# EAGLE design PiZeroGeiger_REV_A (EAGLE 6.3)
CHECKED: C. Granz; DATE: 10.03.2017; DRAWN: C. Granz; DRGNO: 1; ORGANIZATION: Granz Scientific; REV: A; TITLE: PI Zero Geiger
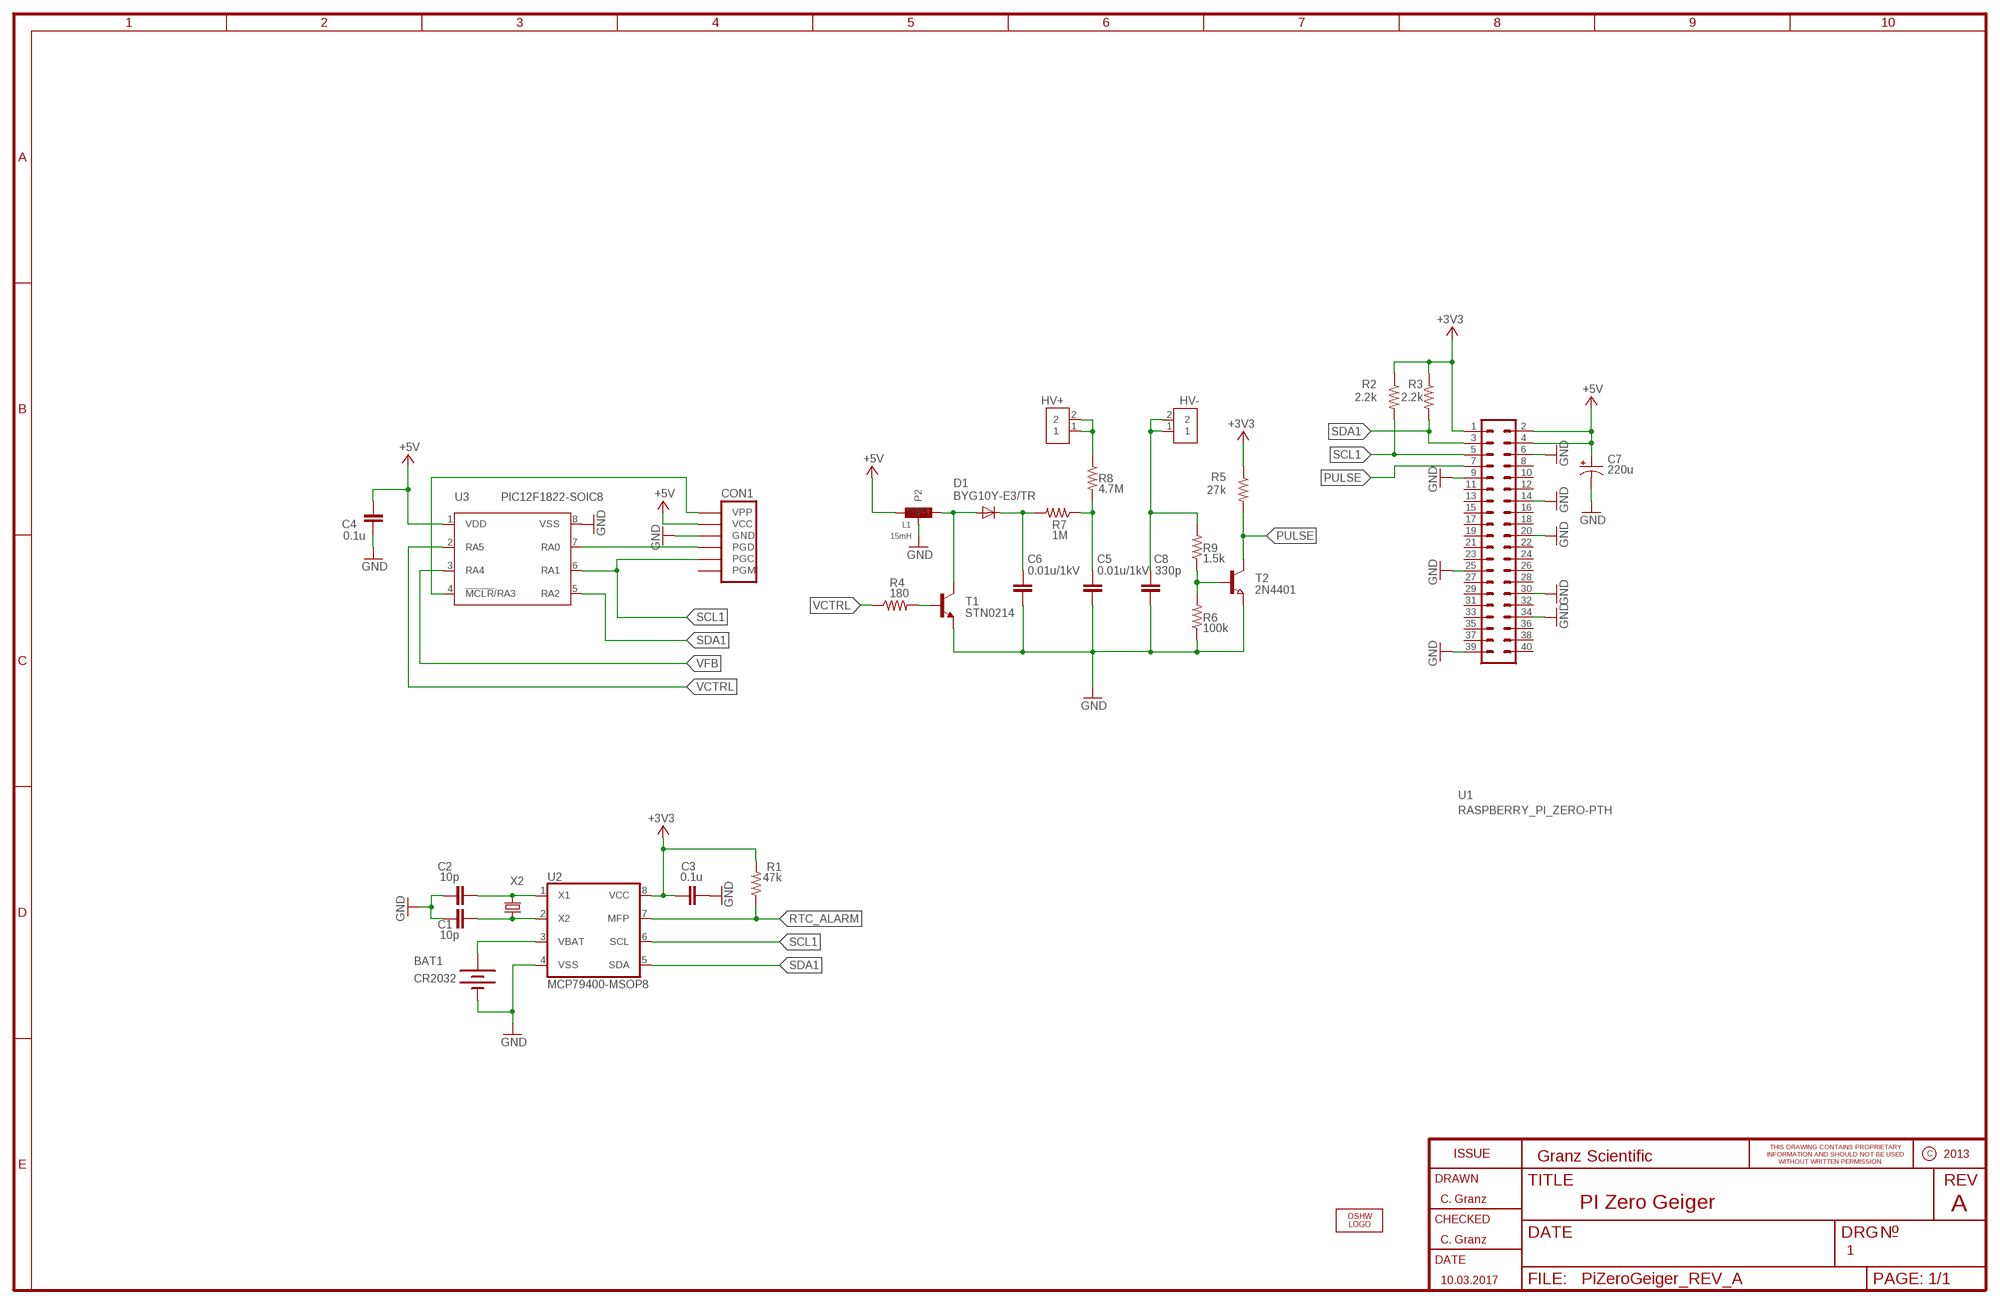
[diagram p0: schematic, sheet 1]

## Parts
BAT1  CR2032  BATTERY-BK-885  [BATTERY_HOLDER_12MM_BK-885]
C1  10p  CAPACITOR-0805  [RCL_0805]
C2  10p  CAPACITOR-0805  [RCL_0805]
C3  0.1u  CAPACITOR-0805  [RCL_0805]
C4  0.1u  CAPACITOR-0805  [RCL_0805]
C5  0.01u/1kV  CAPACITOR-1812  [RCL_1812]
C6  0.01u/1kV  CAPACITOR-1812  [RCL_1812]
C7  220u  CAPACITOR_POLARIZED-PTH-2.5MM-7MM  [CAPACITOR_POLARIZED_PTH_2.5MM-7MM]
C8  330p  CAPACITOR-0805  [RCL_0805]
CON1  CON_PIC_ICSP  [CON_INLINE_TE_640456-6]
D1  BYG10Y-E3/TR  DIODE-DO-214AC  [DO-214AC]
HV+  FUSE_HOLDER-PTH  [FUSE_HOLDER_PTH]
HV-  FUSE_HOLDER-PTH  [FUSE_HOLDER_PTH]
L1  15mH  1200LRS  [1200LRS]
LOGO1  OSHW_LOGO_FILLX0150-NT  [OSHW_FILLX150_NOTEXT]
R1  47k  RESISTOR-0805  [RCL_0805]
R2  2.2k  RESISTOR-0805  [RCL_0805]
R3  2.2k  RESISTOR-0805  [RCL_0805]
R4  180  RESISTOR-0805  [RCL_0805]
R5  27k  RESISTOR-0805  [RCL_0805]
R6  100k  RESISTOR-0805  [RCL_0805]
R7  1M  RESISTOR-0805  [RCL_0805]
R8  4.7M  RESISTOR-0805  [RCL_0805]
R9  1.5k  RESISTOR-0805  [RCL_0805]
T1  STN0214  -NPN-SOT223  [SOT223]
T2  2N4401  NPN-TRANSISTOR_SOT23  [SOT23]
U1  RASPBERRY_PI_ZERO-PTH  [RASPBERRY_PI_ZERO]
U2  MCP79400-MSOP8  [MSOP8]
U3  PIC12F1822-SOIC8  [SOIC8]
X2  32.768 kHz 12.5 pF X1123-ND  CRYSTAL_2_PIN-4.9MM_X_1.8MM  [CRYSTAL_ABRACON_ABS10]

## Nets
+3V3: C3.2 R1.2 R2.1 R3.1 R5.1 U1.1 U2.8(VCC)
+5V: C4.1 C7.+ CON1.5(VCC) L1.P1 U1.2 U1.4 U3.1(VDD)
DIS: R4.2 T1.1(B)
GND: BAT1.- C1.2 C2.2 C3.1 C4.2 C5.2 C6.2 C7.- C8.2 CON1.4(GND) L1.P4(P2) R6.1 T1.3(E) T2.2(E) U1.6 U1.9 U1.14 U1.20 U1.25 U1.30 U1.34 U1.39 U2.4(VSS) U3.8(VSS)
N$2: CON1.6(VPP) U3.4(!MCLR!/RA3)
N$3: C6.1 D1.C R7.2
N$4: CON1.3(PGD) U3.7(RA0)
N$6: D1.A L1.P3 T1.4(C)
N$8: C5.1 R7.1 R8.2
N$9: R6.2 R9.1 T2.1(B)
N$11: C8.1 HV-.1 HV-.2 R9.2
N$12: HV+.1 HV+.2 R8.1
N$29: C1.1 U2.2(X2) X2.1
N$30: C2.1 U2.1(X1) X2.2
N$31: BAT1.+A(+) U2.3(VBAT)
PULSE: R5.2 T2.3(C) U1.7
RTC_ALARM: R1.1 U2.7(MFP)
SCL1: CON1.2(PGC) R2.2 U1.5 U2.6(SCL) U3.6(RA1)
SDA1: R3.2 U1.3 U2.5(SDA) U3.5(RA2)
VCTRL: R4.1 U3.2(RA5)
VFB: U3.3(RA4)
Unconnected: CON1.1(PGM) U1.8 U1.10 U1.11 U1.12 U1.13 U1.15 U1.16 U1.17 U1.18 U1.19 U1.21 U1.22 U1.23 U1.24 U1.26 U1.27 U1.28 U1.29 U1.31 U1.32 U1.33 U1.35 U1.36 U1.37 U1.38 U1.40

## Library data of the parts
BAT1 = CGranz:BATTERY: Battery Various Batteries and Battery Holders.; PN: BK-885-TR
C1 C2 = ArcadianElectronics:CAPACITOR; PN: 08051A100FAT2A
C3 = ArcadianElectronics:CAPACITOR; PN: C0805F104K5RACTU
C4 C8 = CGranz:CAPACITOR: Capacitor Various capacitor sizes.; EAGLEUP: C0805
C5 C6 = CGranz:CAPACITOR: Capacitor Various capacitor sizes.
C7 = CGranz:CAPACITOR_POLARIZED: Polarized Capacitor Various polarized capacitor sizes.
CON1 = CGranz:CON_PIC_ICSP: Microchip PIC ICSP Header OLIMEX style PIC In-Circuit-Serial-Programming header.; PN: 640456-6
D1 = CGranz:DIODE: Diode Various diode sizes.
HV+ HV- = CGranz:FUSE_HOLDER: Fuse Clip PCB mounted fuse clips.; PN: 01020074Z
L1 = murata-inductors:1200LRS
LOGO1 = ohw-logo:OSHW_LOGO_FILL
R1 = ArcadianElectronics:RESISTOR; PN: *
R2-R9 = CGranz:RESISTOR: Resistor Various resistor sizes.; EAGLEUP: R0805
T1 = transistor-neu-to92:*-NPN-: NPN Transistror
T2 = semicon-smd-ipc:NPN-TRANSISTOR_: NPN TRANSISTOR
U1 = CGranz:RASPBERRY_PI_ZERO: Raspberry Pi Zero
U2 = CGranz:MCP79400: Microchip Real-Time Clock IC; PN: MCP79400-I/SN
U3 = CGranz:PIC12F1822: Microchip 8-Bit PIC Microcontroller Microchip Low-end 8-bit PIC microcontroller in various packages.; PN: PIC12F1822-I/SN
X2 = CGranz:CRYSTAL_2_PIN: Crystal Various frequencies and sizes.; PN: ABS10-32.768KHZ-1-T

## Board
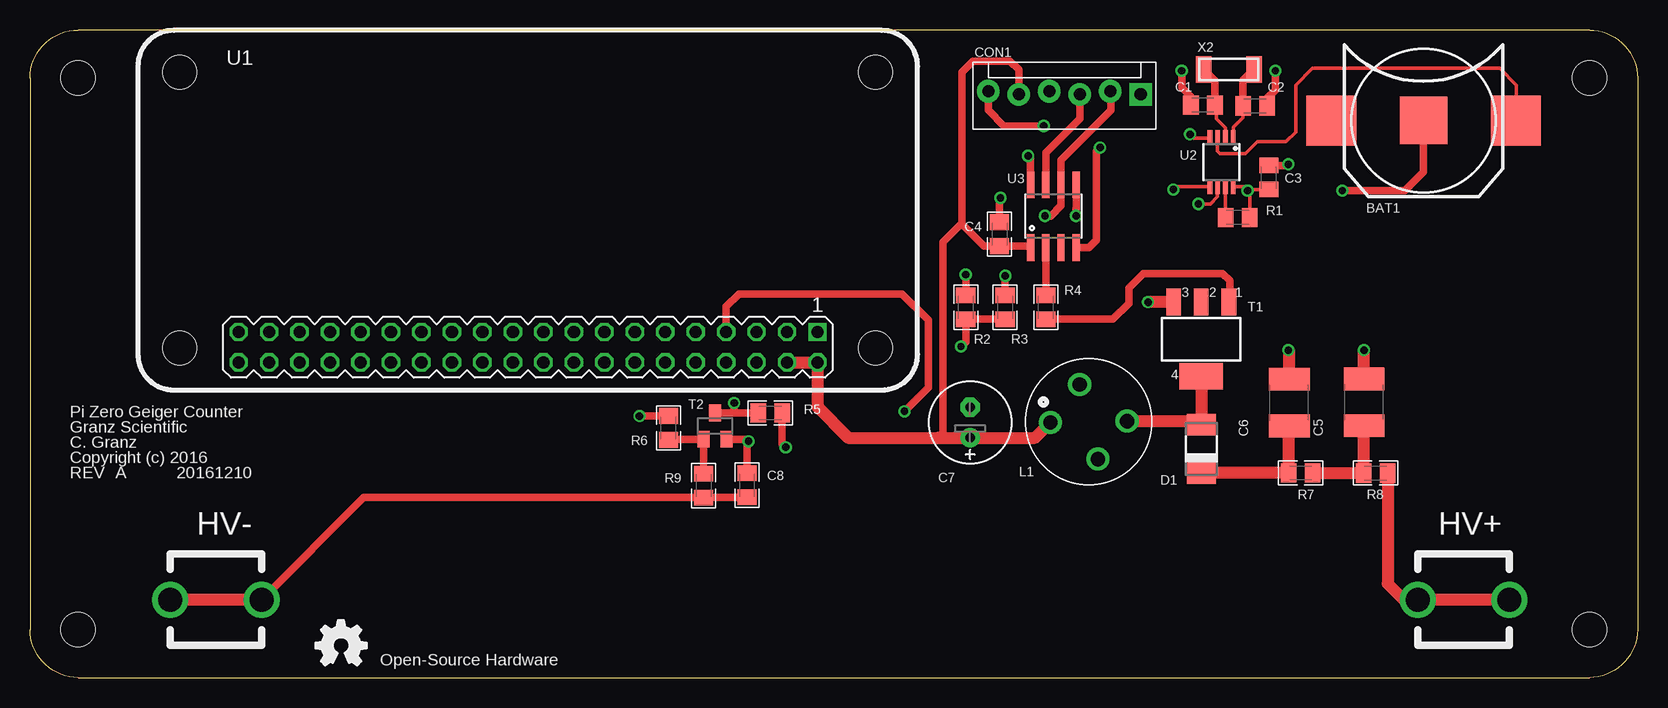
[diagram p1: board, top side]
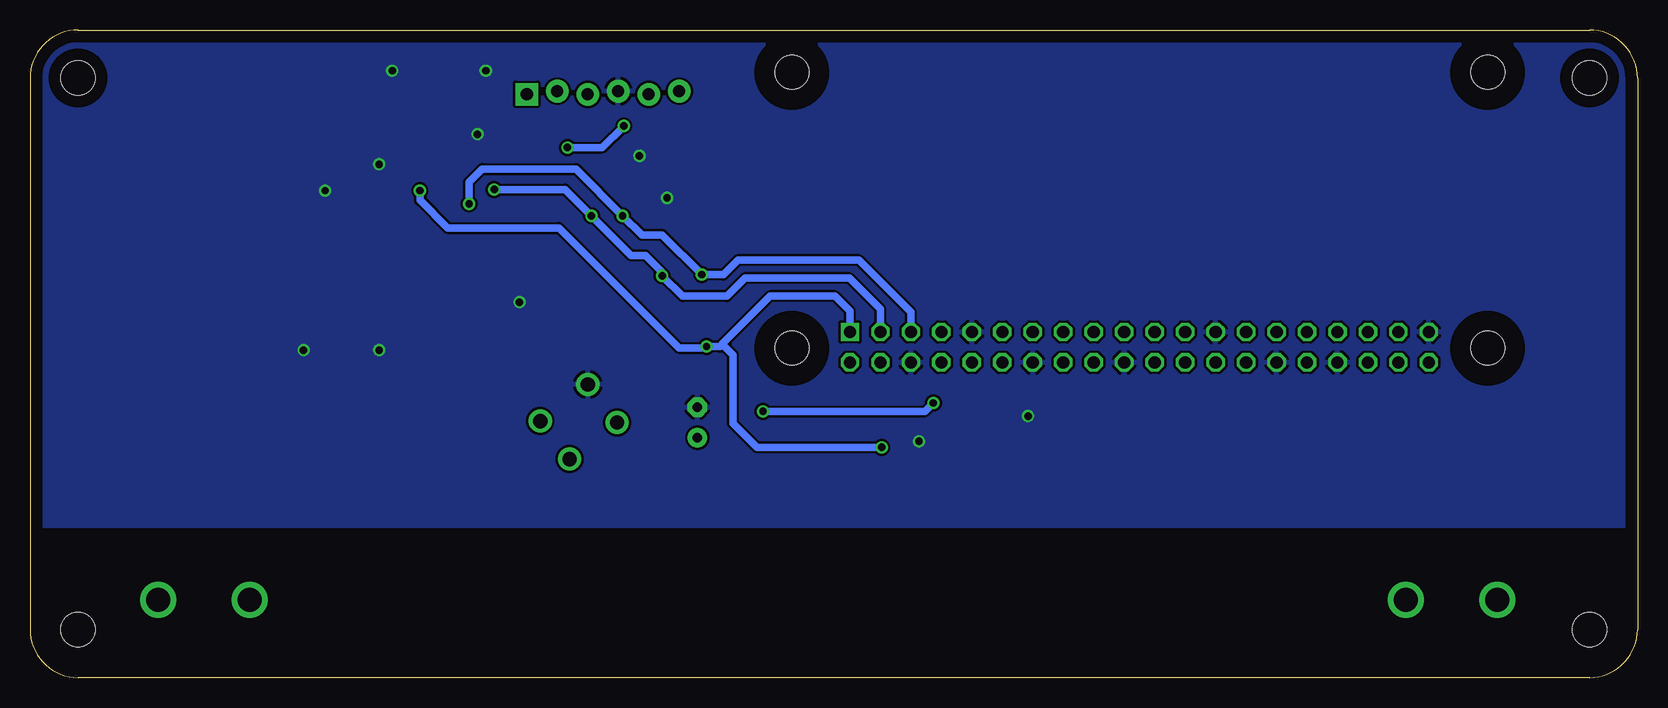
[diagram p2: board, bottom side, seen from below]

Size 134 x 54 mm. Coordinates in mm from the lower left corner, seen from the top.
Outline: 4,0 130,0 arc90 134,4 134,50 arc90 130,54 4,54 arc90 0,50 0,4 arc90 4,0
Copper layers (1*16): Top 0.035mm / dielectric 1.5mm / Bottom 0.035mm
Design rules "default": minimum track width 10mil, minimum drill 24mil, track to track 8mil, track to pad 8mil, pad to pad 8mil, via to via 8mil, smd to smd 8mil, copper to edge 40mil, drill to drill 8mil, minimum pad ring 10mil, minimum via ring 8mil, stop-mask expansion 4mil, vias tented up to drill 0mil, thermal gap 10mil
Holes 2.82 mm at 4,4 4,50 130,50 130,4
tKeepout: area 1,1 to 7,7; area 1,47 to 7,53; area 127,47 to 133,53; area 127,1 to 133,7

### Footprints (pad centres in the part's own frame; a part is rotated, then mirrored left to right if it is on the bottom)
BATTERY_HOLDER_12MM_BK-885 = smd 4.17 x 4.17: +A -7.685,0; +B 7.685,0 | smd 3.96 x 3.96: - 0,0
RCL_0805 = smd 1.3 x 1.6: 1 -1,0; 2 1,0
RCL_1812 = smd 1.9 x 3.4: 1 -1.95,0; 2 1.95,0
CAPACITOR_POLARIZED_PTH_2.5MM-7MM = drill 0.813 pad 1.6: + -1.27,0 | drill 0.813 pad 1.6 octagon: - 1.27,0
CON_INLINE_TE_640456-6 = drill 1.016 pad 1.88 square: 1 -6.35,0.127 | drill 1.016 pad 1.88: 2 -3.81,-0.127; 3 -1.27,0.127; 4 1.27,-0.127; 5 3.81,0.127; 6 6.35,-0.127
DO-214AC = smd 1.8 x 2.4: A 2.025,0; C -2.025,0
FUSE_HOLDER_PTH = drill 2: 1 -3.81,0; 2 3.81,0
1200LRS = drill 1.2 pad 1.93: P1 -2,2.5; P2 -2,-2.5; P3 2,-2.5; P4 2,2.5
SOT223 = smd 1.219 x 2.235: 1 -2.311,-3.099; 2 0,-3.099; 3 2.311,-3.099 | smd 3.6 x 2.2: 4 0,3.099
SOT23 = smd 1 x 1.4: 1 -0.95,-1.1; 2 0.95,-1.1; 3 0,1.1
RASPBERRY_PI_ZERO = drill 1.016 square: 1 8.34,25.15 | drill 1.016 octagon: 2 8.34,27.69; 3 10.88,25.15; 4 10.88,27.69; 5 13.42,25.15; 6 13.42,27.69; 7 15.96,25.15; 8 15.96,27.69; 9 18.5,25.15; 10 18.5,27.69; 11 21.04,25.15; 12 21.04,27.69; 13 23.58,25.15; 14 23.58,27.69; 15 26.12,25.15; 16 26.12,27.69; 17 28.66,25.15; 18 28.66,27.69; 19 31.2,25.15; 20 31.2,27.69; 21 33.74,25.15; 22 33.74,27.69; 23 36.28,25.15; 24 36.28,27.69; 25 38.82,25.15; 26 38.82,27.69; 27 41.36,25.15; 28 41.36,27.69; 29 43.9,25.15; 30 43.9,27.69; 31 46.44,25.15; 32 46.44,27.69; 33 48.98,25.15; 34 48.98,27.69; 35 51.52,25.15; 36 51.52,27.69; 37 54.06,25.15; 38 54.06,27.69; 39 56.6,25.15; 40 56.6,27.69 | hole 2.8: 3.5,3.5; 3.5,26.5; 61.5,26.5; 61.5,3.5
MSOP8 = smd 0.4 x 1.2: 1 -0.975,-2.05; 2 -0.325,-2.05; 3 0.325,-2.05; 4 0.975,-2.05; 5 0.975,2.05; 6 0.325,2.05; 7 -0.325,2.05; 8 -0.975,2.05
SOIC8 = smd 0.61 x 2.21: 1 -1.905,-2.616; 2 -0.635,-2.616; 3 0.635,-2.616; 4 1.905,-2.616; 5 1.905,2.616; 6 0.635,2.616; 7 -0.635,2.616; 8 -1.905,2.616
CRYSTAL_ABRACON_ABS10 = smd 1.3 x 2.2: 1 -2.1,0; 2 2.1,0

### Placement (x,y rotation side)
BAT1  116.15,46.44 180 top
C1  97.77,47.74 180 top
C2  102.12,47.67 0 top
C3  103.26,41.7 270 top
C4  80.82,36.98 90 top
C5  111.2,22.95 90 top
C6  104.97,22.93 90 top
C7  78.37,21.27 90 top
C8  59.77,16.05 90 top
CON1  86.24,48.77 180 top
D1  97.64,19.06 90 top
HV+  119.5,6.5 0 top
HV-  15.5,6.5 0 top
L1  88.26,21.33 52.4 top
LOGO1  23.8,0.99 0 top
R1  100.67,38.36 0 top
R2  78,30.88 90 top
R3  81.29,30.88 90 top
R4  84.68,30.88 270 top
R5  61.7,22.06 180 top
R6  53.22,20.81 270 top
R7  105.93,17.06 180 top
R8  112.17,17.05 180 top
R9  56.15,16.01 270 top
T1  97.63,28.21 180 top
T2  57.1,20.97 0 top
U1  73.99,53.97 180 top
U2  99.32,42.98 180 top
U3  85.31,38.47 0 top
U$1  [INFO_BOARD1]  3.3,16.6 0 top
X2  99.93,50.71 0 top

### Tracks (layer width: path | path; a pad name or v marks a point on that pad's centre or on a via)
+3V3  (via drill 0.6)
  Top 0.305: U2.8 101.17,40.93 v101.5,40.6 | C3.2 101.6,40.7 v101.5,40.6 | R1.2 101.67,40.43 v101.5,40.6
  Top 0.61: R3.1 R2.1 78,28 v77.6,27.6 | R5.1 62.7,19.5 v63,19.2
  Bottom 0.61: U1.1 65.65,30.55 66.9,31.8 72.3,31.8 76.3,27.8 | 76.3,27.8 76.5,27.6 v77.6,27.6 77.7,27.5 79.9,27.5 89.9,37.5 99.2,37.5 101.5,39.8 v101.5,40.6 | v63,19.2 73.4,19.2 75.4,21.2 75.4,26.9 76.3,27.8
+5V
  Top 0.61: U3.1 83.28,35.98 C4.1 80.8,36 79.5,36 77.7,37.8 | CON1.5 82.43,50.67 81.7,51.4 78.6,51.4 77.7,50.5 77.7,37.8 | 77.7,37.8 77.6,37.8 76.1,36.3 76.1,20.2 75.7,20
  Top 1.016: U1.4 U1.2 65.65,22.55 68.2,20 75.7,20 C7.+ 83.79,20 L1.P1
DIS
  Top 0.61: 99.9,31.35 T1.1 | 100,31.25 T1.1 | R4.2 90.28,29.88 91.6,31.2 91.6,32.5 92.8,33.7 99.4,33.7 100,33.1 100,31.37 T1.1
GND  (via drill 0.6)
  Top 0.305: U2.4 98.31,45 97,45 v96.7,45.3
  Top 0.61: U3.8 83.41,43.3 v83.2,43.5 | T2.2 59.73,19.87 v59.9,19.7 59.77,19.57 C8.2 | C4.2 80.82,39.92 v80.9,40 | C2.2 103.12,48.32 103.8,49 v103.8,50.6 | C1.2 96.77,48.43 96,49.2 v96,50.6 | BAT1.- 116.15,42.15 114.6,40.6 v109.4,40.6 | R6.1 v50.81,21.81 v50.8,21.8 | C3.1 104.8,42.7 v104.9,42.8
  Top 1.016: C6.2 104.97,27.27 v104.9,27.3 | C5.2 v111.2,27.3 | T1.3 v93.21,31.31 v93.2,31.3
  pour Bottom: 0.59,53.51 134.14,53.21 134.24,12.69 0.59,12.69
N$2  (via drill 0.6)
  Top 0.61: U3.4 88.25,35.85 88.9,36.5 88.9,43.9 v89.2,44.2 | v84.5,46 81.2,46 79.9,47.3 79.9,48.89 CON1.6
  Bottom 0.61: v89.2,44.2 86.3,44.2 v84.5,46
N$3
  Top 1.016: D1.C 97.67,17.06 R7.2 104.93,20.94 C6.1
N$4
  Top 0.61: U3.7 84.67,43.77 87.5,46.6 CON1.3
N$6
  Top 1.016: T1.4 97.63,21.09 D1.A | D1.A | L1.P3 97.34,21.39 D1.A
N$8
  Top 1.016: R7.1 R8.2 111.17,20.97 C5.1
N$9
  Top 0.61: R9.1 T2.1 53.28,19.87 R6.2
N$11
  Top 0.61: C8.1 59.73,15.01 R9.2 27.82,15.01 HV-.2
  Top 1.016: HV-.1 HV-.2 19.35,6.54
N$12
  Top 1.016: HV+.2 HV+.1 | HV+.1 | R8.1 113.17,7.83 114.5,6.5 HV+.1
N$29
  Top 0.305: U2.2 99.64,45.85 98.9,46.6 98.9,47.61 C1.1
  Top 0.61: C1.1 98.77,49.77 X2.1
N$30
  Top 0.305: U2.1 100.3,45.9 101.1,46.7 101.1,47.65 C2.1
  Top 0.61: C2.1 101.12,49.8 X2.2
N$31
  Top 0.305: U2.3 99,43.91 99.2,43.7 101.3,43.7 102.3,44.7 104.7,44.7 105.5,45.5 105.5,49.4 106.9,50.8 122.5,50.8 123.9,49.4 123.9,46.51 BAT1.+A
PULSE  (via drill 0.6)
  Top 0.61: U1.7 58.03,30.93 59.1,32 72.7,32 74.9,29.8 74.9,24.2 v72.9,22.2 | 57.13,22.1 T2.3 58.8,22.06 | R5.2 58.8,22.06 | v58.7,22.9 58.7,22.16 58.8,22.06
  Bottom 0.61: v72.9,22.2 59.4,22.2 v58.7,22.9
RTC_ALARM
  Top 0.305: U2.7 99.64,38.38 R1.1
SCL1  (via drill 0.6)
  Top 0.305: U2.6 99,40.09 98.4,39.5 v97.4,39.5
  Top 0.61: CON1.2 90.1,48.65 90.1,47.3 85.94,43.15 U3.6 85.94,39.34 85.1,38.5 v84.6,38.5 | R2.2 v78,33.6
  Bottom 0.61: U1.5 60.57,30.47 64.9,34.8 75,34.8 76.2,33.6 v78,33.6 81.3,36.9 83,36.9 v84.6,38.5 88.5,42.4 96.3,42.4 97.4,41.3 v97.4,39.5
SDA1  (via drill 0.6)
  Top 0.305: U2.5 95.53,40.93 v95.3,40.7
  Top 0.61: R3.2 v81.29,33.49 v81.3,33.5 | v87.2,38.5 87.2,39.1 87.22,39.12 U3.5
  Bottom 0.61: U1.3 63.11,30.71 65.7,33.3 74.4,33.3 75.9,31.8 79.6,31.8 v81.3,33.5 81.3,33.8 82.7,35.2 83.9,35.2 v87.2,38.5 89.4,40.7 v95.3,40.7
VCTRL
  Top 0.61: U3.2 R4.1

### Text on the board
tPlace: HV+
tNames: HV- | Open-Source Hardware